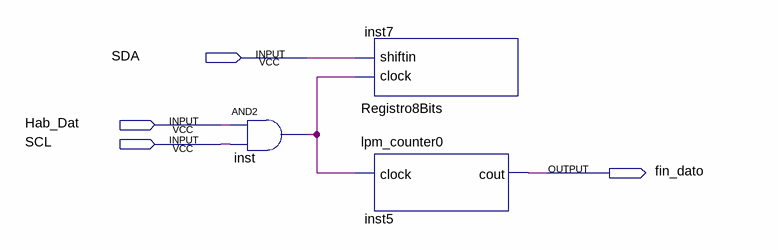
[diagram p0: schematic sheet]
// Quartus schematic esaeslacuestion.bdf as structural Verilog: 3 symbols, 4 pins
module esaeslacuestion (
  input  SDA,
  input  Hab_Dat,
  input  SCL,
  output fin_dato
);

  wire inst_out;

  and inst (inst_out, Hab_Dat, SCL);
  Registro8Bits inst7 (.clock(inst_out), .shiftin(SDA));
  lpm_counter0 inst5 (.clock(inst_out), .cout(fin_dato));
endmodule
